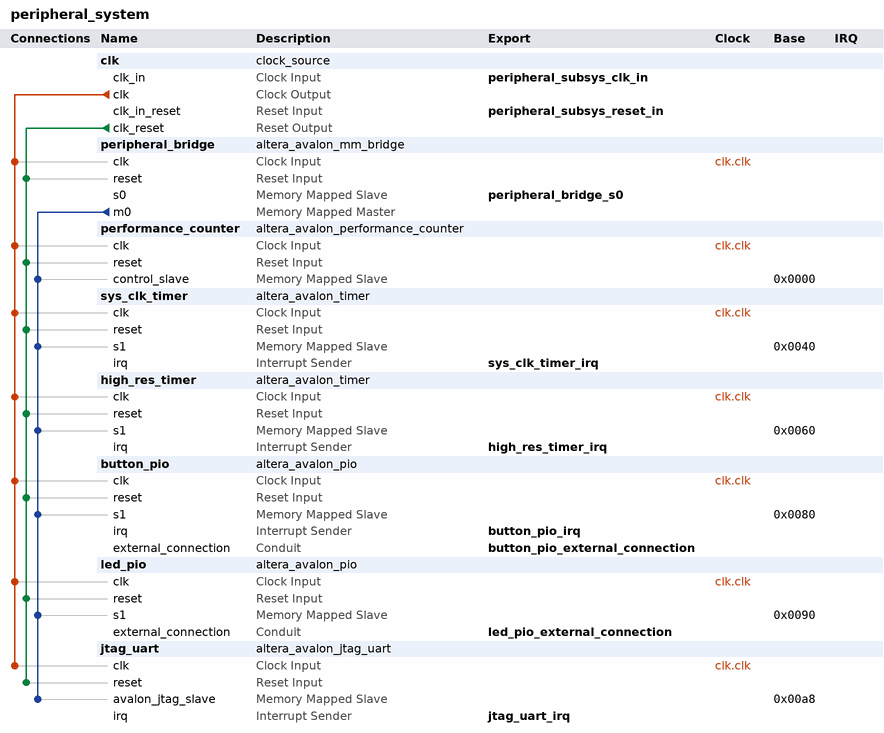
[diagram p0: system contents]
# Platform Designer (Qsys) system peripheral_system, Cyclone V 5CGXFC5C6F27C7
# Parameters at their usual value, and those the tool derives, are not listed.
package require -exact qsys 16.1
create_system peripheral_system
set_project_property DEVICE_FAMILY {Cyclone V}
set_project_property DEVICE 5CGXFC5C6F27C7

add_instance clk clock_source 16.1
set_instance_parameter_value clk clockFrequency 50000000

add_instance peripheral_bridge altera_avalon_mm_bridge 16.1
set_instance_parameter_value peripheral_bridge ADDRESS_UNITS SYMBOLS
set_instance_parameter_value peripheral_bridge ADDRESS_WIDTH 8
set_instance_parameter_value peripheral_bridge DATA_WIDTH 32
set_instance_parameter_value peripheral_bridge MAX_PENDING_RESPONSES 4
set_instance_parameter_value peripheral_bridge USE_AUTO_ADDRESS_WIDTH 0

add_instance performance_counter altera_avalon_performance_counter 16.1
set_instance_parameter_value performance_counter numberOfSections 3

add_instance sys_clk_timer altera_avalon_timer 16.1
set_instance_parameter_value sys_clk_timer period 10.0
set_instance_parameter_value sys_clk_timer periodUnits MSEC

add_instance high_res_timer altera_avalon_timer 16.1
set_instance_parameter_value high_res_timer period 10.0
set_instance_parameter_value high_res_timer periodUnits USEC

add_instance button_pio altera_avalon_pio 16.1
set_instance_parameter_value button_pio captureEdge true
set_instance_parameter_value button_pio direction Input
set_instance_parameter_value button_pio generateIRQ true
set_instance_parameter_value button_pio irqType EDGE
set_instance_parameter_value button_pio simDoTestBenchWiring true
set_instance_parameter_value button_pio simDrivenValue 3
set_instance_parameter_value button_pio width 3

add_instance led_pio altera_avalon_pio 16.1
set_instance_parameter_value led_pio direction Output
set_instance_parameter_value led_pio width 8

add_instance jtag_uart altera_avalon_jtag_uart 16.1
set_instance_parameter_value jtag_uart simInteractiveOptions NO_INTERACTIVE_WINDOWS
set_instance_parameter_value jtag_uart useRegistersForReadBuffer true
set_instance_parameter_value jtag_uart useRegistersForWriteBuffer true

# connections
add_connection clk.clk button_pio.clk clock
add_connection clk.clk high_res_timer.clk clock
add_connection clk.clk jtag_uart.clk clock
add_connection clk.clk led_pio.clk clock
add_connection clk.clk performance_counter.clk clock
add_connection clk.clk peripheral_bridge.clk clock
add_connection clk.clk sys_clk_timer.clk clock
add_connection clk.clk_reset button_pio.reset reset
add_connection clk.clk_reset high_res_timer.reset reset
add_connection clk.clk_reset jtag_uart.reset reset
add_connection clk.clk_reset led_pio.reset reset
add_connection clk.clk_reset performance_counter.reset reset
add_connection clk.clk_reset peripheral_bridge.reset reset
add_connection clk.clk_reset sys_clk_timer.reset reset
add_connection peripheral_bridge.m0 button_pio.s1 avalon
set_connection_parameter_value peripheral_bridge.m0/button_pio.s1 baseAddress 0x0080
add_connection peripheral_bridge.m0 high_res_timer.s1 avalon
set_connection_parameter_value peripheral_bridge.m0/high_res_timer.s1 baseAddress 0x0060
add_connection peripheral_bridge.m0 jtag_uart.avalon_jtag_slave avalon
set_connection_parameter_value peripheral_bridge.m0/jtag_uart.avalon_jtag_slave baseAddress 0x00a8
add_connection peripheral_bridge.m0 led_pio.s1 avalon
set_connection_parameter_value peripheral_bridge.m0/led_pio.s1 baseAddress 0x0090
add_connection peripheral_bridge.m0 performance_counter.control_slave avalon
set_connection_parameter_value peripheral_bridge.m0/performance_counter.control_slave baseAddress 0x0000
add_connection peripheral_bridge.m0 sys_clk_timer.s1 avalon
set_connection_parameter_value peripheral_bridge.m0/sys_clk_timer.s1 baseAddress 0x0040

# exported interfaces
add_interface button_pio_external_connection conduit end
set_interface_property button_pio_external_connection EXPORT_OF button_pio.external_connection
add_interface button_pio_irq interrupt sender
set_interface_property button_pio_irq EXPORT_OF button_pio.irq
add_interface high_res_timer_irq interrupt sender
set_interface_property high_res_timer_irq EXPORT_OF high_res_timer.irq
add_interface jtag_uart_irq interrupt sender
set_interface_property jtag_uart_irq EXPORT_OF jtag_uart.irq
add_interface led_pio_external_connection conduit end
set_interface_property led_pio_external_connection EXPORT_OF led_pio.external_connection
add_interface peripheral_bridge_s0 avalon slave
set_interface_property peripheral_bridge_s0 EXPORT_OF peripheral_bridge.s0
add_interface peripheral_subsys_clk_in clock sink
set_interface_property peripheral_subsys_clk_in EXPORT_OF clk.clk_in
add_interface peripheral_subsys_reset_in reset sink
set_interface_property peripheral_subsys_reset_in EXPORT_OF clk.clk_in_reset
add_interface sys_clk_timer_irq interrupt sender
set_interface_property sys_clk_timer_irq EXPORT_OF sys_clk_timer.irq

set_interconnect_requirement {$system} qsys_mm.clockCrossingAdapter HANDSHAKE
set_interconnect_requirement {$system} qsys_mm.enableEccProtection FALSE
set_interconnect_requirement {$system} qsys_mm.insertDefaultSlave FALSE
set_interconnect_requirement {$system} qsys_mm.maxAdditionalLatency 1

save_system peripheral_system.qsys
